# Altium schematic sheet can_transciever.SchDoc: SN65HVD233 Layout
size A4; DrawnBy: Dylan Vogel; DocumentNumber: 3; Revision: 1.0; SheetNumber: 3; SheetTotal: 11
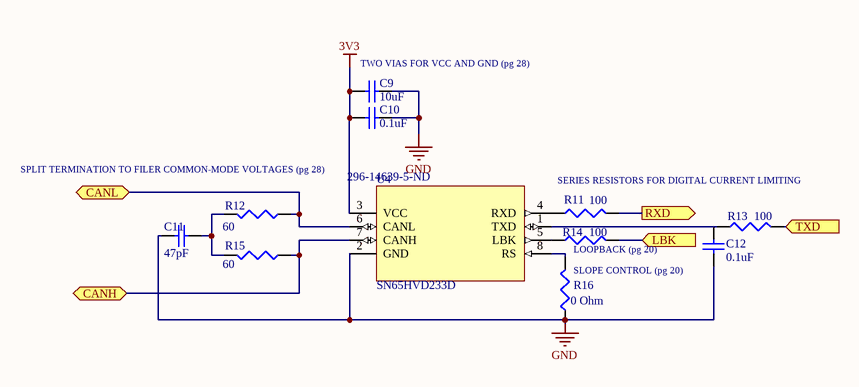
[diagram p0: can_transciever.SchDoc]

## Parts
C9  10uF  [1608[0603]]
C10  0.1uF  [1608[0603]]
C11  47pF  [1608[0603]]
C12  0.1uF  [1608[0603]]
R11  100  [J1-0603]
R12  60  [J1-0603]
R13  100  [J1-0603]
R14  100  [J1-0603]
R15  60  [J1-0603]
R16  0 Ohm  [J1-0603]
U4  SN65HVD233D  Supplier Part Number 1: 296-14639-5-ND  [SOIC127P500X600-8N]

## Ports
CANH (bidir), CANL (bidir), LBK (in), RXD (out), TXD (in)

## Nets
3V3: C9.2 C10.2 U4.3(VCC)
GND: C9.1 C10.1 C11.1 C12.1 R16.1 U4.2(GND)
CANH: R15.1 U4.7(CANH) ; port CANH
CANL: R12.1 U4.6(CANL) ; port CANL
LBK: R14.2 ; port LBK
RXD: R11.2 ; port RXD
TXD: R13.2 ; port TXD
NetC11_2: C11.2 R12.2 R15.2
NetC12_2: C12.2 R13.1 U4.1(TXD)
NetR11_1: R11.1 U4.4(RXD)
NetR14_1: R14.1 U4.5(LBK)
NetR16_2: R16.2 U4.8(RS)

## Notes on the sheet
- (near C9) TWO VIAS FOR VCC AND GND (pg 28)
- SPLIT TERMINATION TO FILER COMMON-MODE VOLTAGES (pg 28)
- SERIES RESISTORS FOR DIGITAL CURRENT LIMITING
- (near R14) LOOPBACK (pg 20)
- (near R16) SLOPE CONTROL (pg 20)

## Library data of the parts
C9-C12 = Cap Semi: Capacitor (Semiconductor SIM Model); Published: 8-Jun-2000; LatestRevisionDate: 29-May-2009; LatestRevisionNote: IPC-7351 Footprint Added.; PackageReference: C1206; Publisher: Altium Limited; PackageDescription: Chip Capacitor; Supplier: Digi-Key
  C9: Value: 10uF; Supplier Part Number: 587-3258-1-ND
  C10 C12: Value: 0.1uF; Supplier Part Number: 587-3807-1-ND
  C11: Value: 47pF; Supplier Part Number: 587-5087-1-ND
R11-R16 = Res3: Resistor; Published: 8-Jun-2000; LatestRevisionDate: 29-May-2009; LatestRevisionNote: IPC-7351 Footprint Added.; PackageReference: J1-0603; Publisher: Altium Limited; PackageDescription: Chip Resistor; Supplier: Digi-Key
  R11 R13 R14: Value: 100
  R12 R15: Value: 60
  R16: Value: 0 Ohm
U4 = SN65HVD233D: 3.3V CAN Transceiver with Standby Mode, Loop-back 8-SOIC -40 to 125; MF: Texas Instruments; MP: SN65HVD233D; Package: SOIC-8 Texas Instruments; Availability: Good; SnapEDA_Link: https://www.snapeda.com/parts/SN65HVD233D/Texas%20Instruments/view-part/?ref=snap; Price: 2.39 USD; Value: *; Supplier 1: Digi-Key; Supplier: Digi-Key